# Altium schematic sheet MPU_8080.SchDoc
size A3; DocumentNumber: 1; SheetNumber: 1; SheetTotal: 1
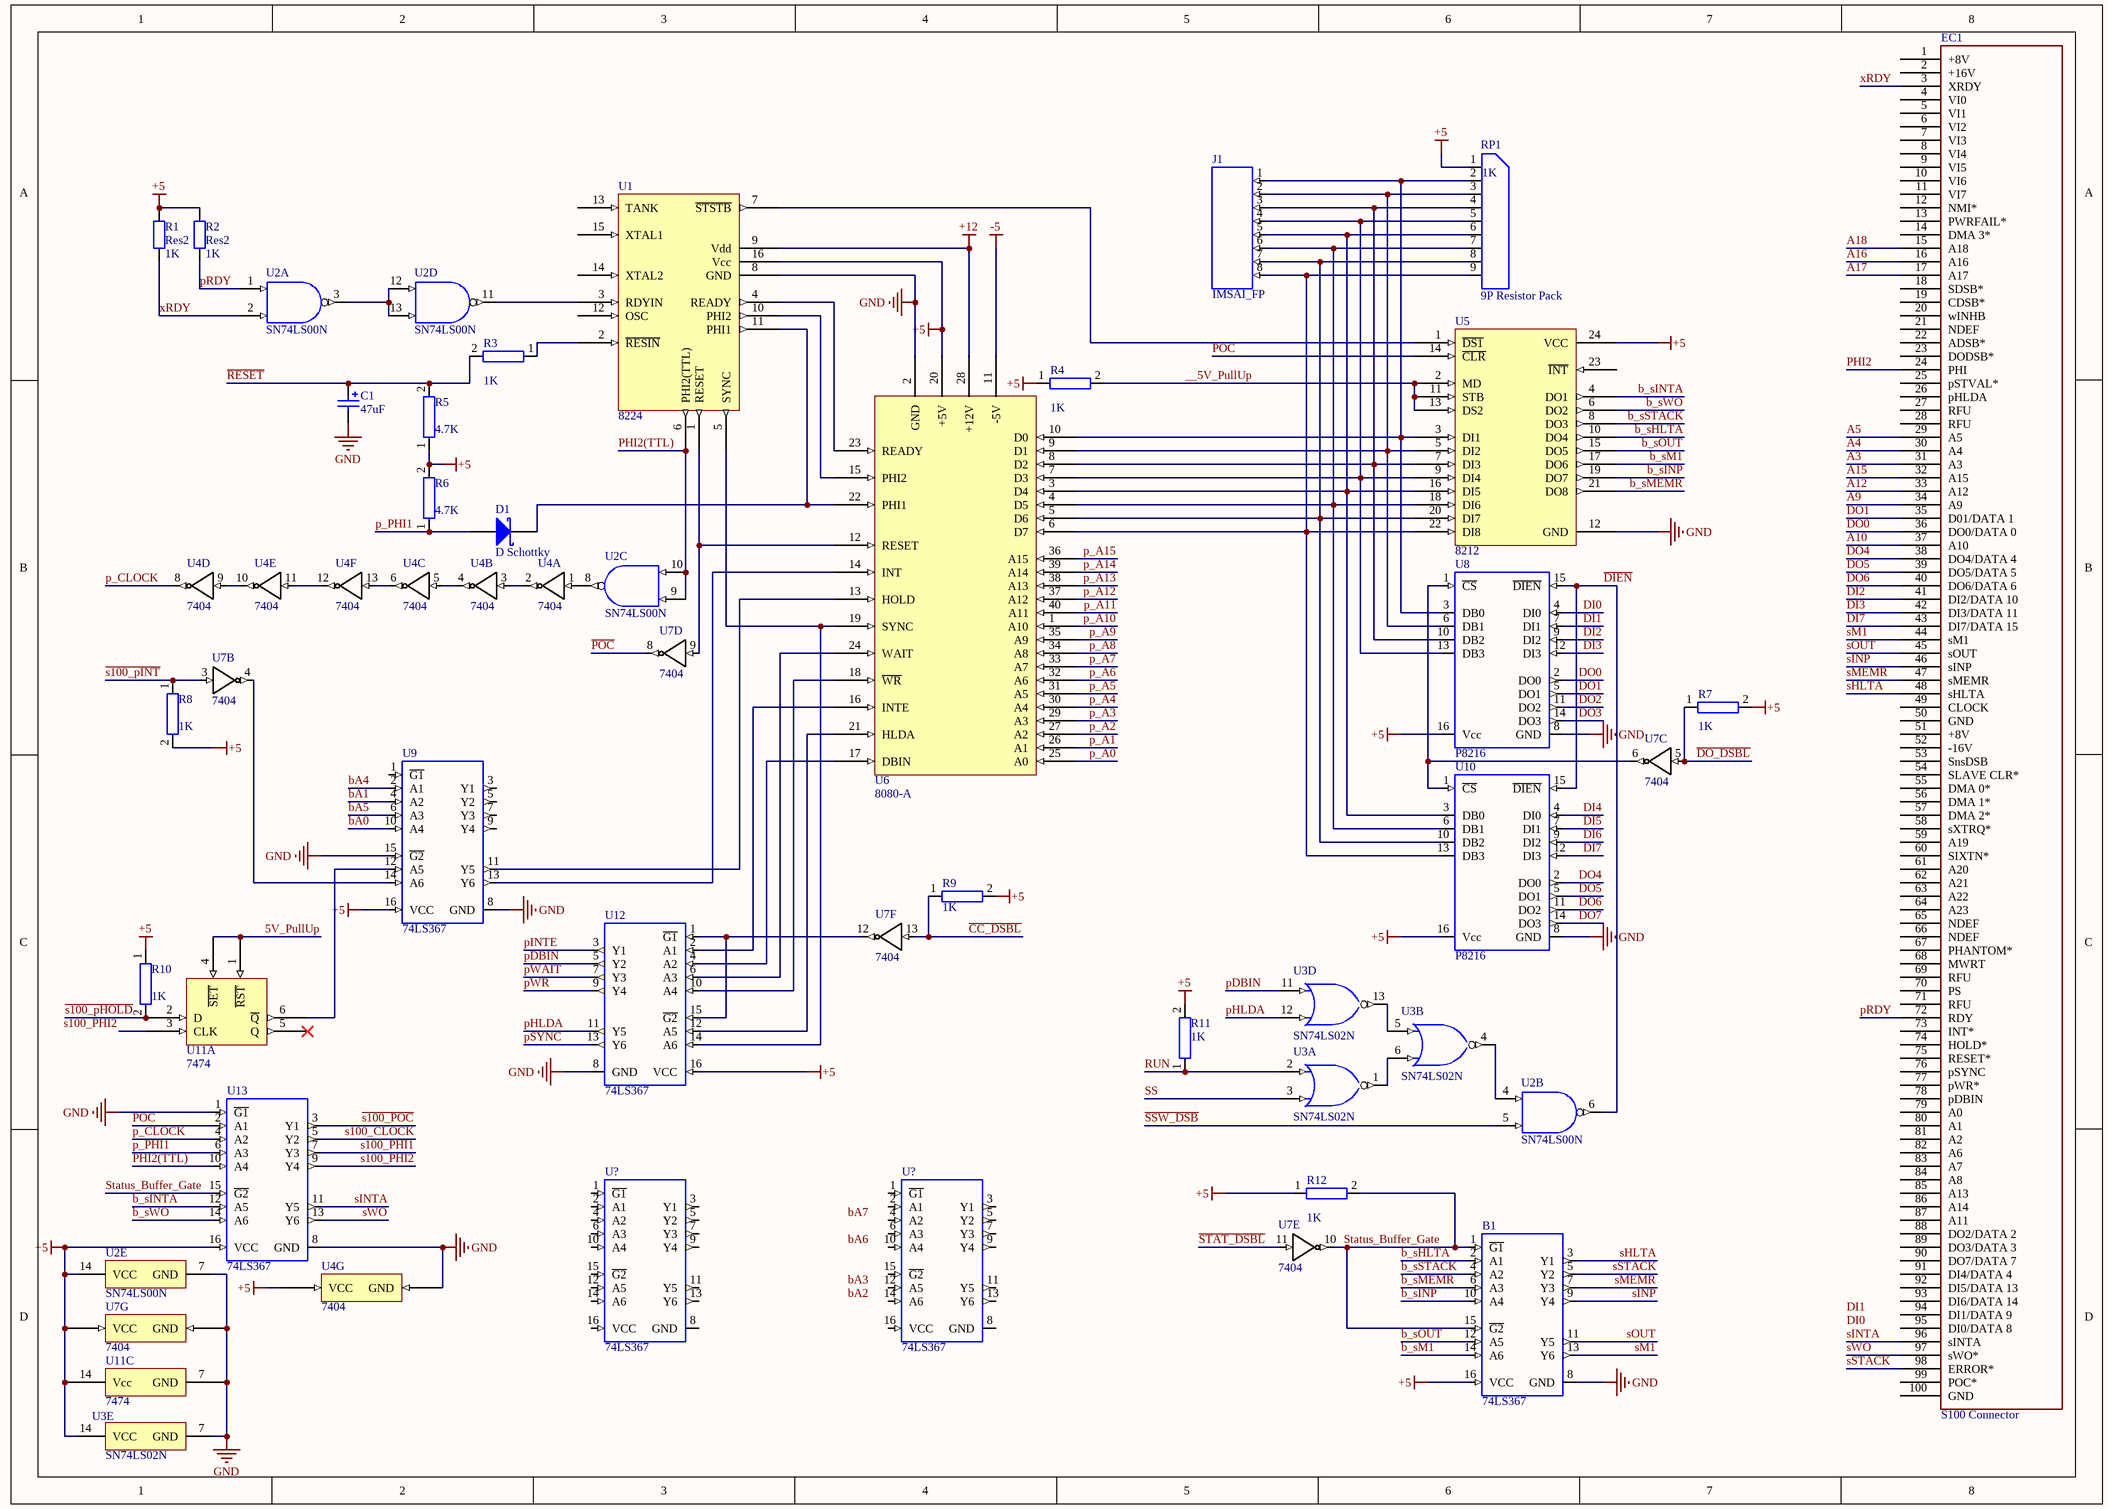
[diagram p0: MPU_8080.SchDoc]

## Parts
(Parts that share a designator on the sheet are numbered #1, #2 ... from top to bottom, then left to right.)
B1  74LS367  [DIP16]
C1  value 47uF  [CAP THT 2.5-6.5-12]  (hidden comment: 6x11 capacitor)
D1  D Schottky  [SMB]
EC1  S100 Connector  [S100]
J1  IMSAI_FP  [DIP16]
R1  Res2  value 1K  [AXIAL-0.4]
R2  Res2  value 1K  [AXIAL-0.4]
R3  value 1K  [1/4W Axial Resistor]  (hidden comment: 1/4 W Resistor)
R4  value 1K  [1/4W Axial Resistor]  (hidden comment: 1/4 W Resistor)
R5  value 4.7K  [1/4W Axial Resistor]  (hidden comment: 1/4 W Resistor)
R6  value 4.7K  [1/4W Axial Resistor]  (hidden comment: 1/4 W Resistor)
R7  value 1K  [1/4W Axial Resistor]  (hidden comment: 1/4 W Resistor)
R8  value 1K  [1/4W Axial Resistor]  (hidden comment: 1/4 W Resistor)
R9  value 1K  [1/4W Axial Resistor]  (hidden comment: 1/4 W Resistor)
R10  value 1K  [1/4W Axial Resistor]  (hidden comment: 1/4 W Resistor)
R11  value 1K  [1/4W Axial Resistor]  (hidden comment: 1/4 W Resistor)
R12  value 1K  [1/4W Axial Resistor]  (hidden comment: 1/4 W Resistor)
RP1  9P Resistor Pack  value 1K  [9P-2.54 ResPack]
U1  8224  [DIP16]
U2  SN74LS00N  [N0014A]  (parts A,B,C,D,E of 5)
U3  SN74LS02N  [N0014A]  (parts A,B,D,E of 5)
U4  7404  [DIP14]  (parts A,B,C,D,E,F,G of 7)
U5  8212  [DIP24-W]
U6  8080-A  [DIP40-W]
U7  7404  [DIP14]  (parts B,C,D,E,F,G of 7)
U8  P8216  [DIP16]
U9  74LS367  [DIP16]
U10  P8216  [DIP16]
U11  7474  [DIP14]  (parts A,C of 3)
U12  74LS367  [DIP16]
U13  74LS367  [DIP16]
U?#1  74LS367  [DIP16]
U?#2  74LS367  [DIP16]

## Nets
+5: B1.16(VCC) R1.2 R2.2 R4.1 R5.1 R6.2 R7.2 R8.2 R9.2 R10.1 R11.2 R12.1 RP1.1 U1.16(Vcc) U2.14(VCC) U3.14(VCC) U4.14(VCC) U5.24(VCC) U6.20(+5V) U7.14(VCC) U8.16(Vcc) U9.16(VCC) U10.16(Vcc) U11.14(Vcc) U12.16(VCC) U13.16(VCC)
+12: U1.9(Vdd) U6.28(+12V)
-5: U6.11(-5V)
GND: B1.8(GND) C1.2 U1.8(GND) U2.7(GND) U3.7(GND) U4.7(GND) U5.12(GND) U6.2(GND) U7.7(GND) U8.8(GND) U9.8(GND) U9.15(~{G2}) U10.8(GND) U11.7(GND) U12.8(GND) U13.1(~{G1}) U13.8(GND)
5V_PullUp: U11.1(~{RST}) U11.4(~{SET})
~{CC_DSBL}: R9.1 U7.13(6A)
~{DIEN}: U2.6(2Y) U8.15(~{DIEN}) U10.15(~{DIEN})
~{DO_DSBL}: R7.1 U7.5(3A)
~{POC}: U7.8(4Y) U13.2(A1)
~{pWR}: U12.9(Y4)
~{RESET}: C1.1 R3.2 R5.2
~{s100_CLOCK}: U13.5(Y2)
~{s100_pHOLD}: R10.2 U11.2(D)
~{s100_pINT}: R8.1 U7.3(2A)
~{s100_POC}: U13.3(Y1)
~{SSW_DSB}: U2.5(2B)
~{STAT_DSBL}: U7.11(5A)
__5V_PullUp: R4.2 U5.2(MD) U5.11(STB) U5.13(DS2)
A3: EC1.31(A3)
A4: EC1.30(A4)
A5: EC1.29(A5)
A9: EC1.34(A9)
A10: EC1.37(A10)
A12: EC1.33(A12)
A15: EC1.32(A15)
A16: EC1.16(A16)
A17: EC1.17(A17)
A18: EC1.15(A18)
b_sHLTA: B1.2(A1) U5.10(DO4)
b_sINP: B1.10(A4) U5.19(DO7)
b_sINTA: U5.4(DO1) U13.12(A5)
b_sM1: B1.14(A6) U5.17(DO6)
b_sMEMR: B1.6(A3) U5.21(DO8)
b_sOUT: B1.12(A5) U5.15(DO5)
b_sSTACK: B1.4(A2) U5.8(DO3)
b_sWO: U5.6(DO2) U13.14(A6)
bA0: U9.10(A4)
bA1: U9.4(A2)
bA4: U9.2(A1)
bA5: U9.6(A3)
DI0: U8.4(DI0)
DI1: U8.7(DI1)
DI2: EC1.41(DI2/DATA_10) U8.9(DI2)
DI3: EC1.42(DI3/DATA_11) U8.12(DI3)
DI4: U10.4(DI0)
DI5: U10.7(DI1)
DI6: U10.9(DI2)
DI7: EC1.43(DI7/DATA_15) U10.12(DI3)
DO0: EC1.36(DO0/DATA_0) U8.2(DO0)
DO1: EC1.35(D01/DATA_1) U8.5(DO1)
DO2: U8.11(DO2)
DO3: U8.14(DO3)
DO4: EC1.38(DO4/DATA_4) U10.2(DO0)
DO5: EC1.39(DO5/DATA_5) U10.5(DO1)
DO6: EC1.40(DO6/DATA_6) U10.11(DO2)
DO7: U10.14(DO3)
p_A0: U6.25(A0)
p_A1: U6.26(A1)
p_A2: U6.27(A2)
p_A3: U6.29(A3)
p_A4: U6.30(A4)
p_A5: U6.31(A5)
p_A6: U6.32(A6)
p_A7: U6.33(A7)
p_A8: U6.34(A8)
p_A9: U6.35(A9)
p_A10: U6.1(A10)
p_A11: U6.40(A11)
p_A12: U6.37(A12)
p_A13: U6.38(A13)
p_A14: U6.39(A14)
p_A15: U6.36(A15)
p_CLOCK: U4.8(4Y) U13.4(A2)
p_PHI1: D1.1(A) R6.1 U13.6(A3)
pDBIN: U3.11(4A) U12.5(Y2)
PHI2: EC1.24(PHI)
PHI2(TTL): U1.6(PHI2(TTL)) U2.9(3A) U2.10(3B) U13.10(A4)
pHLDA: U3.12(4B) U12.11(Y5)
pINTE: U12.3(Y1)
POC: U5.14(~{CLR})
pRDY: EC1.72(RDY) R2.1 U2.1(1A)
pSYNC: U12.13(Y6)
pWAIT: U12.7(Y3)
RUN: R11.1 U3.2(1A)
s100_PHI1: U13.7(Y3)
s100_PHI2: U11.3(CLK) U13.9(Y4)
sHLTA: B1.3(Y1) EC1.48(sHLTA)
sINP: B1.9(Y4) EC1.46(sINP)
sINTA: EC1.96(sINTA) U13.11(Y5)
sM1: B1.13(Y6) EC1.44(sM1)
sMEMR: B1.7(Y3) EC1.47(sMEMR)
sOUT: B1.11(Y5) EC1.45(sOUT)
SS: U3.3(1B)
sSTACK: B1.5(Y2) EC1.98(ERROR*)
Status_Buffer_Gate: B1.1(~{G1}) B1.15(~{G2}) R12.2 U7.10(5Y) U13.15(~{G2})
sWO: EC1.97(sWO*) U13.13(Y6)
xRDY: EC1.3(XRDY) R1.1 U2.2(1B)
NetD1_2: D1.2(K) U1.11(PHI1) U6.22(PHI1)
NetJ1_1: J1.1 RP1.2 U5.3(DI1) U6.10(D0) U8.3(DB0)
NetJ1_2: J1.2 RP1.3 U5.5(DI2) U6.9(D1) U8.6(DB1)
NetJ1_3: J1.3 RP1.4 U5.7(DI3) U6.8(D2) U8.10(DB2)
NetJ1_4: J1.4 RP1.5 U5.9(DI4) U6.7(D3) U8.13(DB3)
NetJ1_5: J1.5 RP1.6 U5.16(DI5) U6.3(D4) U10.3(DB0)
NetJ1_6: J1.6 RP1.7 U5.18(DI6) U6.4(D5) U10.6(DB1)
NetJ1_7: J1.7 RP1.8 U5.20(DI7) U6.5(D6) U10.10(DB2)
NetJ1_8: J1.8 RP1.9 U5.22(DI8) U6.6(D7) U10.13(DB3)
NetR3_1: R3.1 U1.2(~{RESIN})
NetU1_1: U1.1(RESET) U6.12(RESET) U7.9(4A)
NetU1_3: U1.3(RDYIN) U2.11(4Y)
NetU1_4: U1.4(READY) U6.23(READY)
NetU1_5: U1.5(SYNC) U6.19(SYNC) U12.14(A6)
NetU1_7: U1.7(~{STSTB}) U5.1(~{DS1})
NetU1_10: U1.10(PHI2) U6.15(PHI2)
NetU2_3: U2.3(1Y) U2.12(4A) U2.13(4B)
NetU2_4: U2.4(2A) U3.4(2Y)
NetU2_8: U2.8(3Y) U4.1(1A)
NetU3_1: U3.1(1Y) U3.6(2B)
NetU3_5: U3.5(2A) U3.13(4Y)
NetU4_2: U4.2(1Y) U4.3(2A)
NetU4_4: U4.4(2Y) U4.5(3A)
NetU4_6: U4.6(3Y) U4.13(6A)
NetU4_9: U4.9(4A) U4.10(5Y)
NetU4_11: U4.11(5A) U4.12(6Y)
NetU6_13: U6.13(HOLD) U9.11(Y5)
NetU6_14: U6.14(INT) U9.13(Y6)
NetU6_16: U6.16(INTE) U12.2(A1)
NetU6_17: U6.17(DBIN) U12.4(A2)
NetU6_18: U6.18(~{WR}) U12.10(A4)
NetU6_21: U6.21(HLDA) U12.12(A5)
NetU6_24: U6.24(WAIT) U12.6(A3)
NetU7_4: U7.4(2Y) U9.14(A6)
NetU7_6: U7.6(3Y) U8.1(~{CS}) U10.1(~{CS})
NetU7_12: U7.12(6Y) U12.1(~{G1}) U12.15(~{G2})
NetU9_12: U9.12(A5) U11.6(~{Q})

Not connected (* = marked no-connect by the designer): EC1 1(+8V) 2(+16V) 4(VI0) 5(VI1) 6(VI2) 7(VI3) 8(VI4) 9(VI5) 10(VI6) 11(VI7) 12(NMI*) 13(PWRFAIL*) 14(DMA_3*) 18(SDSB*) 19(CDSB*) 20(wINHB) 21(NDEF) 22(ADSB*) 23(DODSB*) 25(pSTVAL*) 26(pHLDA) 27(RFU) 28(RFU) 49(CLOCK ) 50(GND) 51(+8V) 52(-16V) 53(SnsDSB) 54(SLAVE_CLR*) 55(DMA_0*) 56(DMA_1*) 57(DMA_2*) 58(sXTRQ*) 59(A19) 60(SIXTN*) 61(A20) 62(A21) 63(A22) 64(A23) 65(NDEF) 66(NDEF) 67(PHANTOM*) 68(MWRT) 69(RFU) 70(PS) 71(RFU) 73(INT*) 74(HOLD* ) 75(RESET*) 76(pSYNC) 77(pWR*  ) 78(pDBIN  ) 79(A0) 80(A1) 81(A2) 82(A6) 83(A7) 84(A8) 85(A13) 86(A14) 87(A11) 88(DO2/DATA_2) 89(DO3/DATA_3) 90(DO7/DATA_7) 91(DI4/DATA_4) 92(DI5/DATA_13) 93(DI6/DATA_14) 94(DI1/DATA_9) 95(DI0/DATA_8) 99(POC*) 100(GND); U1 12(OSC) 13(TANK) 14(XTAL2) 15(XTAL1); U5 23(~{INT}); U9 1(~{G1}) 3(Y1) 5(Y2) 7(Y3) 9(Y4); U11 5(Q)*; U?#1 1(~{G1}) 2(A1) 3(Y1) 4(A2) 5(Y2) 6(A3) 7(Y3) 8(GND) 9(Y4) 10(A4) 11(Y5) 12(A5) 13(Y6) 14(A6) 15(~{G2}) 16(VCC); U?#2 1(~{G1}) 2(A1) 3(Y1) 4(A2) 5(Y2) 6(A3) 7(Y3) 8(GND) 9(Y4) 10(A4) 11(Y5) 12(A5) 13(Y6) 14(A6) 15(~{G2}) 16(VCC)

## Notes on the sheet
- Labels drawn without touching a wire or pin: bA2, bA3, bA6, bA7, DI0, DI1

## Library data of the parts
D1 = D Schottky: Schottky Diode; Published: 8-Jun-2000; LatestRevisionDate: 17-Jul-2002; LatestRevisionNote: Re-released for DXP Platform.; PackageReference: SMB; Publisher: Altium Limited; PackageDescription: DO-214-AA/SMB; 2 C-Bend Leads; Body 5.3 x 3.6 mm, inc. leads (LxW); Code_JEDEC: DO-214-AA
J1 = IMSAI_FP_Connector: pin to pad: 1>1+16 2>2+15 3>3+14 4>4+14 5>5+12 6>6+11 7>7+10 8>8+9
R1 R2 = Res2: Resistor; Published: 8-Jun-2000; LatestRevisionDate: 17-Jul-2002; LatestRevisionNote: Re-released for DXP Platform.; PackageReference: AXIAL-0.4; Publisher: Altium Limited; PackageDescription: Axial Device, Thru-Hole; 2 Leads; 0.4 in Pin Spacing
R3-R12 = 1/4 W Resistor: 1/4W Resistor
U1 = D8224: 8224 Clock Generator for 8080-A
U2 = SN74LS00N: Quad 2-input positive-NAND gates, N0014A, TUBE; Manufacturer: Texas Instruments; VCC(Min)(V): 4.75; VCC(Max)(V): 5.25; Output Type: TTL; ICC @ Nom Voltage(Max)(mA): 0.022; Bits(#): 4; F @ Nom Voltage(Max)(Mhz): 35; Rating: Catalog; Technology Family: LS; Voltage(Nom)(V): 5; Schmitt Trigger: No; Output Drive (IOL/IOH)(Max)(mA): 0.4/-16; tpd @ Nom Voltage(Max)(ns): 22; DatasheetVersion: SDLS025B; PackageReference: N0014A; Supplier 1: Mouser; Supplier Part Number 1: 595-SN74LS00N; Supplier 2: Digi-Key; Supplier Part Number 2: 296-1626-5-ND; Generic Part Number: SN74LS00; Input Type: TTL; Operating Temperature Range(C): 0 to 70; Code_JEDEC: MS-001; PartNumber: SN74LS00N; ComponentLink1Description: Manufacturer URL; ComponentLink1URL: http://www.ti.com/; ComponentLink2Description: Datasheet; ComponentLink2URL: http://www.ti.com/lit/ds/symlink/sn74ls00.pdf; ComponentLink3Description: Package Specification; ComponentLink3URL: http://www.ti.com/lit/ml/mpdi002c/mpdi002c.pdf
U3 = SN74LS02N: Quad 2-input positive-NOR gates, N0014A, TUBE; Manufacturer: Texas Instruments; VCC(Min)(V): 4.75; VCC(Max)(V): 5.25; Output Type: TTL; Bits(#): 4; Rating: Catalog; tpd @ Nom Voltage(Max)(ns): 22; ICC @ Nom Voltage(Max)(mA): 0.027; F @ Nom Voltage(Max)(Mhz): 35; Voltage(Nom)(V): 5; Output Drive (IOL/IOH)(Max)(mA): 0.4/-8; DatasheetVersion: SDLS027; PackageReference: N0014A; Generic Part Number: SN74LS02; Input Type: TTL; Operating Temperature Range(C): 0 to 70; Code_JEDEC: MS-001; PartNumber: SN74LS02N; ComponentLink1Description: Manufacturer URL; ComponentLink1URL: http://www.ti.com/; ComponentLink2Description: Datasheet; ComponentLink2URL: http://www.ti.com/lit/ds/symlink/sn74ls02.pdf; ComponentLink3Description: Package Specification; ComponentLink3URL: http://www.ti.com/lit/ml/mpdi002c/mpdi002c.pdf
U4 U7 = 7404: Hex Inverter
U5 = P8212: Intel P8212 Output Port
U8 U10 = P8216: Intel P8216 4-bit Parallel Bidirectional Bus Driver
U11 = 7474: 74xx74 D Latch
C1 = 6x11 capacitor: Published: 8-Jun-2000; LatestRevisionDate: 17-Jul-2002; LatestRevisionNote: Re-released for DXP Platform.; PackageReference: RB7.6-15; Publisher: Altium Limited; PackageDescription: Polarized Capacitor (Radial); 2 Leads